# EasyEDA Pro project ProProject_扫描隧道显微镜OpenSTM_2023-08-25.epro, schematic MCUBoard
Create Date: 2022-03-06; Page Name: P1; Project Name: STM-New-Structure; Schematic Name: MCUBoard; Update Date: 2022-12-23; Add into BOM: yes; Convert to PCB: yes
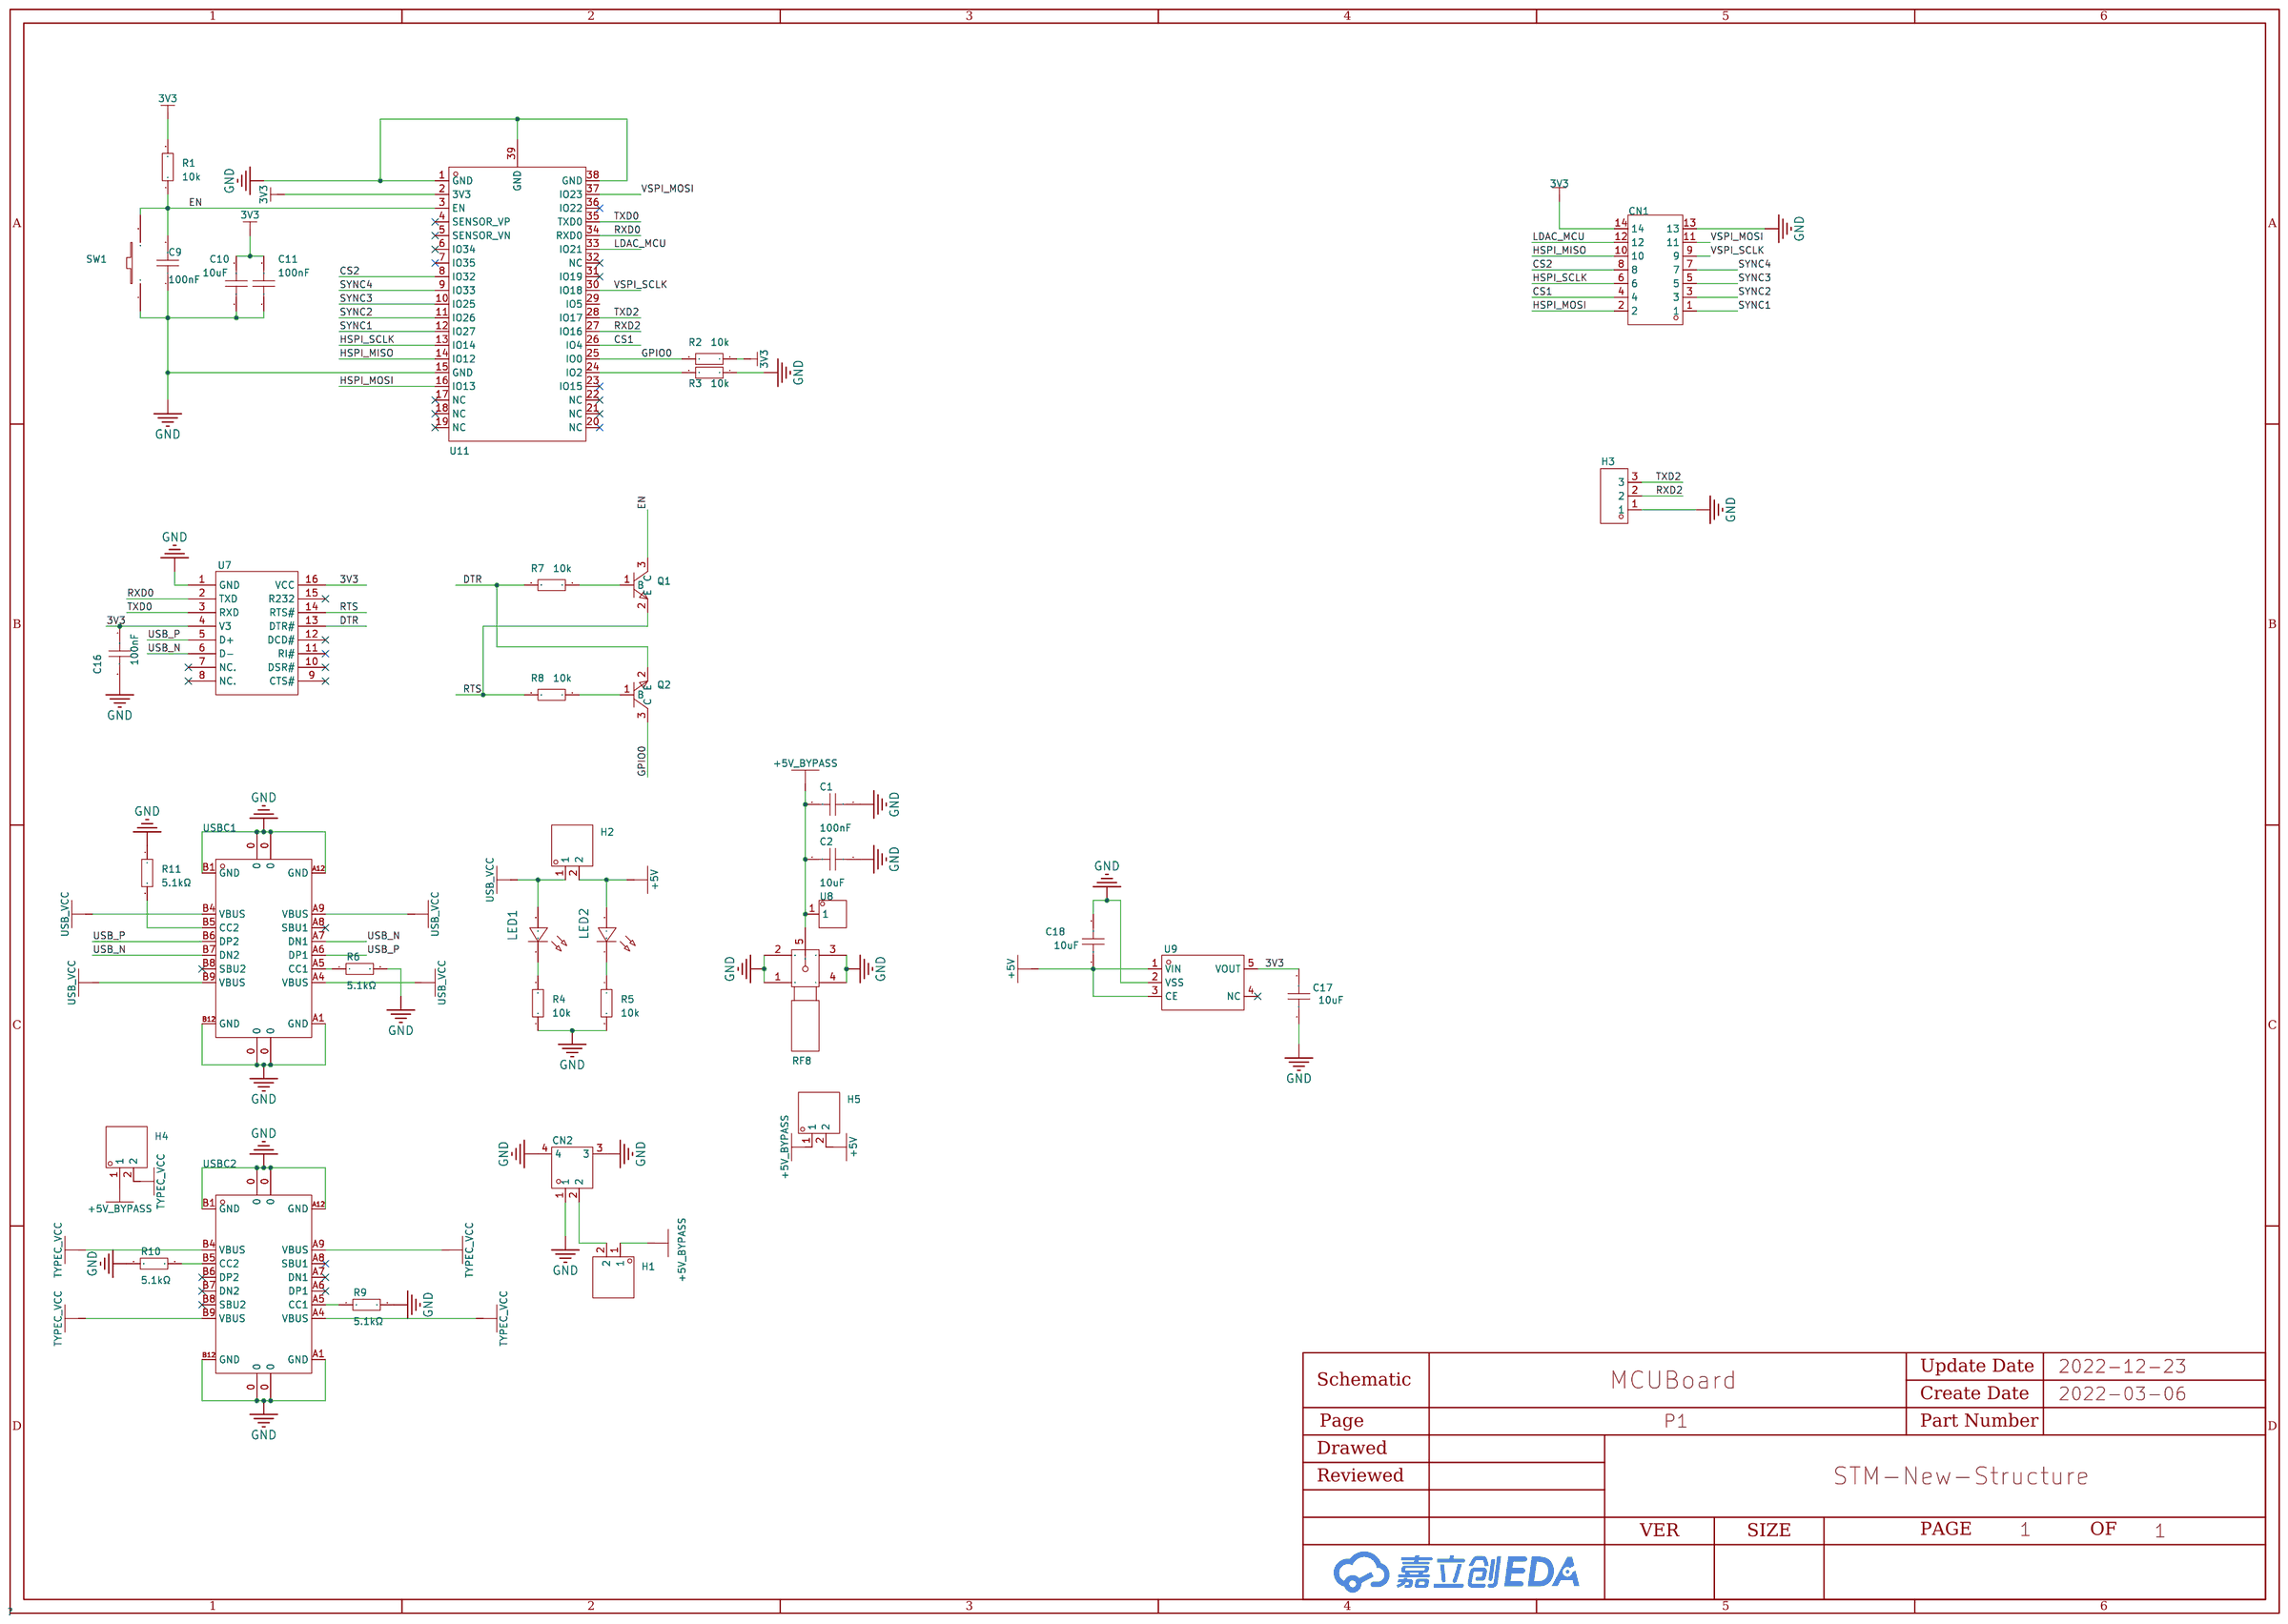
[diagram p2: schematic sheet]

## Parts
C1  100nF  [C0603]
C2  10uF  [C0603]
C9  100nF  [C0603]
C10  10uF  [C0603]
C11  100nF  [C0603]
C16  100nF  [C0603]
C17  10uF  [C0603]
C18  10uF  [C0603]
CN1  -  [CONN-TH_14P-P2.54_XKB_X9555WR-2X7-6TV01]
CN2  -  [CONN-TH_XT30PW-M]
H1  -  [HDR-TH_2P-P2.54-V-M-1]
H2  -  [HDR-TH_2P-P2.54-V-M-1]
H3  -  [HDR-TH_3P-P2.54-H-M-BW7.2-P]
H4  -  [HDR-TH_2P-P2.54-V-M-1]
H5  -  [HDR-TH_2P-P2.54-V-M-1]
LED1  -  [LED0603-RD_BLUE]
LED2  -  [LED0603-RD_BLUE]
Q1  -  [SOT-23-3_L2.9-W1.3-P1.90-LS2.4-BR]
Q2  -  [SOT-23-3_L2.9-W1.3-P1.90-LS2.4-BR]
R1  10k  [R0603]
R2  10k  [R0603]
R3  10k  [R0603]
R4  10k  [R0603]
R5  10k  [R0603]
R6  5.1kΩ  [R0603]
R7  10k  [R0603]
R8  10k  [R0603]
R9  5.1kΩ  [R0603]
R10  5.1kΩ  [R0603]
R11  5.1kΩ  [R0603]
RF8  -  [SMA-TH_BWSMA-KWE-Z001]
SW1  -  [KEY-SMD_2P-L6.0-W6.0-P6.00]
U7  -  [SOP-16_L10.0-W3.9-P1.27-LS6.0-BL]
U8  -  [TEST-SMD_L2.7-W1.0]
U9  -  [SOT-23-5_L3.0-W1.7-P0.95-LS2.8-BR]
U11  ESP32-WROOM-32E-N8  [WIFI-SMD_ESP32-WROOM-32E]
USBC1  -  [USB-C_SMD-TYPE-C-31-M-12]
USBC2  -  [USB-C_SMD-TYPE-C-31-M-12]

## Library data of the parts
C1 C11 = CL10B104KA8NNNC: 容值:100nF;精度:±10%;额定电压:25V;温度系数:X7R;; LCSC Part Name: 100nF±10%25V; Supplier Part: C1590; Manufacturer: SAMSUNG(三星); Supplier Footprint: 0603; JLCPCB Part Class: ExtendedPart; Datasheet: https://atta.szlcsc.com/upload/public/pdf/source/20160103/1457707680294.pdf; Supplier: LCSC; Tolerance: ±10%; Voltage Rated: 25V; Temperature Coefficient: X7R
C2 C10 = GRM188R61E106MA73D: 容值:10uF;精度:±20%;额定电压:25V;温度系数:X5R;; LCSC Part Name: 10uF±20%25V; Supplier Part: C91606; Manufacturer: muRata(村田); Supplier Footprint: 0603; JLCPCB Part Class: ExtendedPart; Datasheet: https://atta.szlcsc.com/upload/public/pdf/source/20161226/1482720176185.pdf; Supplier: LCSC; Tolerance: ±20%; Voltage Rated: 25V; Temperature Coefficient: X5R
C9 C16 = CC0603KRX7R9BB104: 容值:100nF;精度:±10%;额定电压:50V;温度系数:X7R;; LCSC Part Name: 100nF±10%50V; Supplier Part: C14663; Manufacturer: YAGEO(国巨); Supplier Footprint: 0603; JLCPCB Part Class: BasicPart; Datasheet: https://atta.szlcsc.com/upload/public/pdf/source/20170116/1484561234239.pdf; Supplier: LCSC; Tolerance: ±10%; Voltage Rated: 50V; Temperature Coefficient: X7R
C17 C18 = CL10A106MP8NNNC: 容值:10uF;精度:±20%;额定电压:10V;温度系数:X5R;; LCSC Part Name: 10uF±20%10V; Supplier Part: C85713; Manufacturer: SAMSUNG(三星); Supplier Footprint: 0603; JLCPCB Part Class: ExtendedPart; Datasheet: https://atta.szlcsc.com/upload/public/pdf/source/20161027/1477535406017.pdf; Supplier: LCSC; Tolerance: ±20%; Voltage Rated: 10V; Temperature Coefficient: X5R
CN1 = X9555WR-2x07-6TV01: 参考系列:-;间距:2.54mm;插针结构:2x7P;排数:2;每排PIN数:7;行距:2.54mm;公母:公型插针;安装方式:弯插;额定电流:3A;触头材质:黄铜;触头镀层:金;工作温度范围:-25℃~+85℃;焊接温度(最大值):260℃;; LCSC Part Name: 2.54mm2x7P弯插; Supplier Part: C2884505; Manufacturer: XKBConnectivity(中国星坤); Supplier Footprint: 弯插,P=2.54mm; JLCPCB Part Class: ExtendedPart; Datasheet: https://atta.szlcsc.com/upload/public/pdf/source/20211009/ED69AC5D0B165AFEE3838F4DF324EF6E.pdf; Supplier: LCSC; Pitch: 2.54mm; Pins Structure: 2x7P; Number of Rows: 2; Number of PINs Per Row: 7; Row Spacing: 2.54mm; Gender: 公型插针; Mounting Style: 弯插; Current Rating (Max): 3A; Contact Material: 黄铜; Contact Plating: 金; Operating Temperature Range: -25℃~+85℃; Welding Temperature (Max): 260℃
CN2 = XT30PW-M: Socket,DCsupply,XT30,male,PIN:2; LCSC Part Name: XT30PW-M公头; Supplier Part: C431092; Manufacturer: AMASS(艾迈斯); JLCPCB Part Class: ExtendedPart; Datasheet: https://atta.szlcsc.com/upload/public/pdf/source/20220222/6A9F22F7850E25B33E1BE430ADF8560B.pdf; Supplier: LCSC
H1 H2 H4 H5 = HDR-M_2.54_1x2P: Supplier Part: C124375; Supplier Footprint: 插件
H3 = 2.54-1*3P正弯针: 间距:2.54mm;总PIN位数:3;排数:1;插针结构:1x3P;行距:-;安装类型:弯插;圆针/方针:方针;额定电流:3A;额定电压:-;配合针长度:3mm;塑高:2.54mm;端接针长度:-;触头材质:-;触头镀层:-;工作温度范围:-55℃~+105℃;颜色:黑色;; LCSC Part Name: 2.54mm1x3P弯插方针; Supplier Part: C92159; Manufacturer: BOOMELE(博穆精密); Supplier Footprint: 插件,P=2.54mm; JLCPCB Part Class: ExtendedPart; Datasheet: https://atta.szlcsc.com/upload/public/pdf/source/20181121/C2334_B051029C4931EB562F9DCCAAD18AC88A.pdf; Supplier: LCSC; Pitch: 2.54mm; Number of Pins: 3; Number of Rows: 1; Pin Structure: 1x3P; Mounting Type: 弯插; Circluar Pins/Square Pins: 方针; Current Rating (Max): 3A; Length of Mating Pin: 3mm; Insulation Height: 2.54mm; Operating Temperature Range: -55℃~+105℃; Color: 黑色
LED1 LED2 = LED_0603-R: 发光颜色:红灯;二极管配置:-;透镜颜色:无色透明;主波长:617.5nm;峰值波长:632nm;色温:-;光通量(25℃时):-;测试电流:5mA;正向电压(VF):2.2V;发光强度:28.5mcd;功率:60mW;发光角度:120°;安装方式:-;工作温度:-40℃~+85℃;; Supplier Footprint: 0603; Supplier Part: C72044
Q1 Q2 = S8050LT1 J3Y: LCSC Part Name: S8050; Supplier Part: C2926165; Manufacturer: FOSAN(富信); Manufacturer Part: S8050LT1J3Y; Supplier Footprint: SOT-23; JLCPCB Part Class: ExtendedPart; Datasheet: https://atta.szlcsc.com/upload/public/pdf/source/20211203/FAF9E446EEEFA352739C30D23AB52B1B.pdf; Supplier: LCSC
R1-R5 R7 R8 = RC0603JR-0710KL: 电阻类型:厚膜电阻;阻值:10k;精度:±5%;功率:100mW;温度系数:±100ppm/;最大工作电压:75V;工作温度范围:-55~+125;; LCSC Part Name: 10k ±5%; Supplier Part: C99198; Manufacturer: YAGEO(国巨); Supplier Footprint: 0603; JLCPCB Part Class: ExtendedPart; Datasheet: https://atta.szlcsc.com/upload/public/pdf/source/20181223/C99198_917934A193F41F77D9F7D214A8C79116.pdf; Supplier: LCSC; Type: 厚膜电阻; Tolerance: ±5%; Power(Watts): 100mW; Temperature Coefficient: ±100ppm/; Overload Voltage (Max): 75V; Operating Temperature Range: -55~+125
R6 R9-R11 = 0603WAF5101T5E: 电阻类型:厚膜电阻;阻值:5.1kΩ;精度:±1%;功率:100mW;温度系数:±100ppm/℃;最大工作电压:75V;工作温度范围:-55℃~+155℃;; LCSC Part Name: 5.1kΩ±1%100mW; Supplier Part: C23186; Manufacturer: UNI-ROYAL(厚声); Supplier Footprint: 0603; JLCPCB Part Class: BasicPart; Datasheet: https://atta.szlcsc.com/upload/public/pdf/source/20200306/C422600_1E6D84923E4A46A82E41ADD87F860B5C.pdf; Supplier: LCSC; Type: 厚膜电阻; Tolerance: ±1%; Power(Watts): 100mW; Temperature Coefficient: ±100ppm/℃; Overload Voltage (Max): 75V; Operating Temperature Range: -55℃~+155℃
RF8 = BWSMA-KWE-Z001: 连接器类型:板端;射频系列:SMA;接口类型:内孔;端口数量:1;阻抗:-;频率-最大值:-;样式:弯头;接口直径:5.3mm;接口长度/高度:-;工作温度范围:-;; LCSC Part Name: SMA内孔弯头SMA天线座SMA弯头正脚板端座子; Supplier Part: C496551; Manufacturer: BATWIRELESS(蝙蝠无线); Supplier Footprint: 插件; JLCPCB Part Class: ExtendedPart; Datasheet: https://atta.szlcsc.com/upload/public/pdf/source/20201015/C496551_6AE7B02D24D60B4F78A8937E4C4F8093.pdf; Supplier: LCSC; Connector Type: 板端; RF Series: SMA; Interface Type: 内孔; Number of Ports: 1; Style: 弯头; Interface Diameter: 5.3mm
SW1 = K2-1817UQ-C4SW-01: 触点电流:50mA;额定电压(DC):12V;绝缘电阻:100M;电路结构:单刀单掷;安装方式:立贴;按钮形状:圆形按钮;带灯:-;作用力:250gf@±30gf;机械寿命:100000;工作温度:-25~+85;开关长度:6mm;开关宽度:6mm;开关高度:5mm;; LCSC Part Name: 无声开关6.0mm*6.0mm*5mm250G; Supplier Part: C128939; Manufacturer: 韩国韩荣; Supplier Footprint: SMD; JLCPCB Part Class: ExtendedPart; Datasheet: https://atta.szlcsc.com/upload/public/pdf/source/20210322/C2690010_58F7DD7E136B4BFA712F0D44F3FEADD9.pdf; Supplier: LCSC; Contact Current: 50mA; Voltage Rating (DC): 12V; Insulation Resistance: 100M; Circuit: 单刀单掷; Mounting Style: 立贴; Actuator Style: 圆形按钮; Operating Force: 250gf@±30gf; Mechanical Life: 100000; Operating Temperature: -25~+85; Switch Length: 6mm; Switch Width: 6mm; Switch Height: 5mm
U7 = CH340C: 类型:Transceiver;协议类别:USB2.0;驱动器/接收器数:-;数据速率:2Mbps;; Supplier Part: C84681; Manufacturer: WCH(南京沁恒); Supplier Footprint: SOP-16_150mil; JLCPCB Part Class: ExtendedPart; Datasheet: https://atta.szlcsc.com/upload/public/pdf/source/20200819/C84681_ADBED554CE321879DBD6B1D06488689C.pdf; Supplier: LCSC; Type: Transceiver; Protocol: USB2.0; Data Rate: 2Mbps; Supply Voltage: 3.3V,5V
U8 = 5017: 连接器类型:测试点/测试环;颜色:-;; LCSC Part Name: 测试点/测试环; Supplier Part: C238130; Manufacturer: Keystone; JLCPCB Part Class: ExtendedPart; Datasheet: https://atta.szlcsc.com/upload/public/pdf/source/20180629/C238130_5A26801579F58754781F264880A43AC8.PDF; Supplier: LCSC; Connector Type: 测试点/测试环
U9 = ME6217C33M5G: 输出类型:固定;输出极性:正;输出通道数:1;最大输入电压:7V;输出电压:3.3V;压差:180mV@(300mA);静态电流(地电流):-;输出电流:800mA;电源纹波抑制比(PRSS):65dB@(1kHz);; LCSC Part Name: Vin=7VVout=3.3V800mA65dB@(1kHz); Supplier Part: C427602; Manufacturer: MICRONE(南京微盟); Supplier Footprint: SOT-23-5; JLCPCB Part Class: ExtendedPart; Datasheet: https://atta.szlcsc.com/upload/public/pdf/source/20190910/C427602_D4B9162A2E9D9EF57C60010DFDECEF37.pdf; Supplier: LCSC; Output Type: 固定; Output Polarity: 正; Number of Outputs: 1; Maximum Input Voltage: 7V; Output Voltage: 3.3V; Dropout Voltage: 180mV@(300mA); Output Current: 800mA; Power Supply Rejection Ratio (PRSS): 65dB@(1kHz)
U11 = ESP32-WROOM-32E-N8_C701342: ESP32-WROOM-32E集成ESP32-D0WD-V3芯片，具有?高的稳定性和安全性能。; LCSC Part Name: PCB板载天线模组; Supplier Part: C701342; Manufacturer: ESPRESSIF(乐鑫); Supplier Footprint: SMD-38P,18x25.5x3.1mm; JLCPCB Part Class: ExtendedPart; Datasheet: https://atta.szlcsc.com/upload/public/pdf/source/20200730/C701341_95E089979D39CD8D2471FDC7C7AF29A1.pdf; Supplier: LCSC
USBC1 USBC2 = TYPE-C-31-M-12: 连接器类型:Type-C;标准:-;公母:母座;触点数量:16;端口数量:1;额定电流 - 电源:250mA;; LCSC Part Name: Type-C 母座; Supplier Part: C165948; Manufacturer: 韩国韩荣; Supplier Footprint: SMD; JLCPCB Part Class: Extended Part; Datasheet: https://atta.szlcsc.com/upload/public/pdf/source/20210111/C2682493_D8CCFED08835E878D16ACCF4460E43B8.pdf; Supplier: LCSC; Connector Type: Type-C; Gender: 母座; Number of Contacts: 16; Number of Ports: 1; Current Rating - Power (Max): 250mA

## Nets
3V3: C10.2 C11.2 C16.1 C17.2 CN1.14 R1.2 R2.1 U7.4(V3) U7.16(VCC) U9.5(VOUT) U11.2(3V3)
+5V: C18.1 H2.2 H5.2 LED2.2(A) U9.1(VIN) U9.3(CE)
+5V_BYPASS: C1.2 C2.2 H1.1 H4.1 H5.1 RF8.5 U8.1
GND: C1.1 C2.1 C9.1 C10.1 C11.1 C16.2 C17.1 C18.2 CN1.13 CN2.1 CN2.3 CN2.4 H3.1 R3.1 R4.1 R5.2 R6.2 R9.2 R10.1 R11.1 RF8.1 RF8.2 RF8.3 RF8.4 SW1.1 U7.1(GND) U9.2(VSS) U11.1(GND) U11.15(GND) U11.38(GND) U11.39(GND) USBC1.0 USBC1.A1(GND) USBC1.A12(GND) USBC1.B1(GND) USBC1.B12(GND) USBC2.0 USBC2.A1(GND) USBC2.A12(GND) USBC2.B1(GND) USBC2.B12(GND)
CS1: CN1.4 U11.26(IO4)
CS2: CN1.8 U11.8(IO32)
DTR: Q2.2(E) R7.2 U7.13(DTR#)
EN: C9.2 Q1.3(C) R1.1 SW1.2 U11.3(EN)
GPIO0: Q2.3(C) R2.2 U11.25(IO0)
HSPI_MISO: CN1.10 U11.14(IO12)
HSPI_MOSI: CN1.2 U11.16(IO13)
HSPI_SCLK: CN1.6 U11.13(IO14)
LDAC_MCU: CN1.12 U11.33(IO21)
RTS: Q1.2(E) R8.2 U7.14(RTS#)
RXD0: U7.2(TXD) U11.34(RXD0)
RXD2: H3.2 U11.27(IO16)
SYNC1: CN1.1 U11.12(IO27)
SYNC2: CN1.3 U11.11(IO26)
SYNC3: CN1.5 U11.10(IO25)
SYNC4: CN1.7 U11.9(IO33)
TXD0: U7.3(RXD) U11.35(TXD0)
TXD2: H3.3 U11.28(IO17)
TYPEC_VCC: H4.2 USBC2.A4(VBUS) USBC2.A9(VBUS) USBC2.B4(VBUS) USBC2.B9(VBUS)
USB_N: U7.6(D-) USBC1.A7(DN1) USBC1.B7(DN2)
USB_P: U7.5(D+) USBC1.A6(DP1) USBC1.B6(DP2)
USB_VCC: H2.1 LED1.2(A) USBC1.A4(VBUS) USBC1.A9(VBUS) USBC1.B4(VBUS) USBC1.B9(VBUS)
VSPI_MOSI: CN1.11 U11.37(IO23)
VSPI_SCLK: CN1.9 U11.30(IO18)
$1N26140: Q1.1(B) R7.1
$1N26141: Q2.1(B) R8.1
$1N50028: LED1.1(C) R4.2
$1N50054: LED2.1(C) R5.1
$1N55680: CN2.2 H1.2
$1N60322: R10.2 USBC2.B5(CC2)
$1N60417: R9.1 USBC2.A5(CC1)
$1N61298: R11.2 USBC1.B5(CC2)
$1N61403: R6.1 USBC1.A5(CC1)
$1N65378: R3.2 U11.24(IO2)

Not connected (* = marked no-connect by the designer): U7 7(NC.)* 8(NC.)* 9(CTS#)* 10(DSR#)* 11(RI#)* 12(DCD#)* 15(R232)*; U9 4(NC)*; U11 4(SENSOR_VP)* 5(SENSOR_VN)* 6(IO34)* 7(IO35)* 17(NC)* 18(NC)* 19(NC)* 20(NC)* 21(NC)* 22(NC)* 23(IO15)* 29(IO5) 31(IO19)* 32(NC)* 36(IO22)*; USBC1 A8(SBU1)* B8(SBU2)*; USBC2 A6(DP1)* A7(DN1)* A8(SBU1)* B6(DP2)* B7(DN2)* B8(SBU2)*
